# Altium project ESP32_IoT Gateaway.PrjPcb (part 2 of 2)

## Sheet SD Card.SchDoc
size 152 x 152 mm
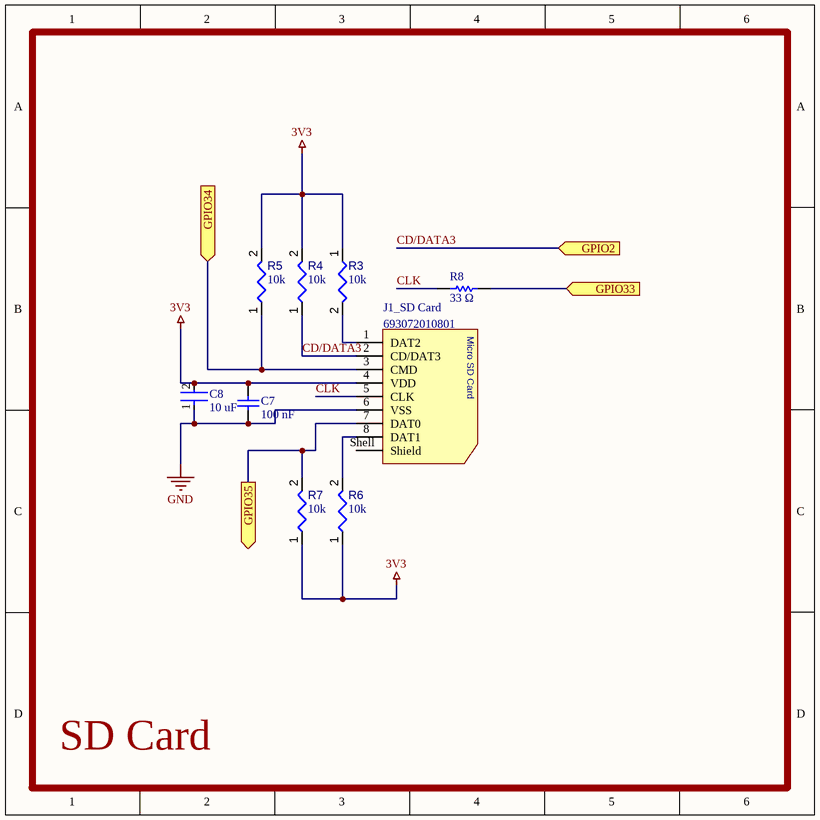
[diagram p6: SD Card.SchDoc]

### Parts
C7  100 nF  [MURA-0603_H_0.9_M]
C8  10 uF  [FP-GRM188-0_1-e0_2_0_55-IPC_A]
J1_SD_Card  693072010801  [693072010801]
R3  value 10k  [RESC1608X55X25ML10T15]  (hidden comment: Resistor 10k +/-1% 0603 100 mW)
R4  value 10k  [RESC1608X55X25ML10T15]  (hidden comment: Resistor 10k +/-1% 0603 100 mW)
R5  value 10k  [RESC1608X55X25ML10T15]  (hidden comment: Resistor 10k +/-1% 0603 100 mW)
R6  value 10k  [RESC1608X55X25ML10T15]  (hidden comment: Resistor 10k +/-1% 0603 100 mW)
R7  value 10k  [RESC1608X55X25ML10T15]  (hidden comment: Resistor 10k +/-1% 0603 100 mW)
R8  33 Ω  [RESC1608X55X25LL10T15]

### Ports
GPIO2 (in), GPIO33 (in), GPIO34 (in), GPIO35 (out)

### Nets
3V3: C7.1 C8.2 J1_SD_Card.4(VDD) R3.1 R4.2 R5.2 R6.1 R7.1
GND: C7.2 C8.1 J1_SD_Card.6(VSS)
CD/DATA3: J1_SD_Card.2(CD/DAT3) R4.1 ; port GPIO2
CLK: J1_SD_Card.5(CLK) R8.2
NetESP32S3_38: R8.1 ; port GPIO33
NetESP32S3_39: J1_SD_Card.3(CMD) R5.1 ; port GPIO34
NetESP32S3_40: J1_SD_Card.7(DAT0) R7.2 ; port GPIO35
NetJ1_SD_Card_1: J1_SD_Card.1(DAT2) R3.2
NetJ1_SD_Card_8: J1_SD_Card.8(DAT1) R6.2

Not connected (* = marked no-connect by the designer): J1_SD_Card Shell(Shield)

### Notes on the sheet
- SD Card
- (in symbol CMP-1502-00164-3) Micro SD Card

### Library data of the parts
C7 = CMP-2000-05253-1: CAP, Ceramic, 0.1 uF, 10%, 16 V, 0603, RoHS, Tape and Reel; Manufacturer: Murata; Capacitance - pF: 100000pF; Case Length: 1.6mm; Voltage Rating DC: 16V; Brand: MurataElectronics; Temperature Coefficient / Code: +/-15%; Case Width: 0.8mm; Type: GeneralPurposeMLCC; Capacitance: 0.1uF; Dielectric: X7R; Capacitance - nF: 100nF; Product Category: MultilayerCeramicCapacitorsMLCC-SMD/SMT; Datasheet URL: https://datasheet.ciiva.com/29202/451467-da-01-en-vs-kondensator-0603-29202287.pdf; Termination Style: SMD/SMT; Operating Temperature Range: -55Cto+125C; Case Code - in: 0603; Datasheet Version: Dec-10; Dimensions: 0.8mmWx1.6mmLx0.8mmH; RoHS: Details; Case Code - mm: 1608; Product: GeneralTypeMLCCs; Voltage Rating: 16V; Package / Case: 0603(1608metric); Factory Pack Quantity: 4000; Packaging: Reel; Maximum Operating Temperature: +125C; Manufacturer URL: http://www.murata.com/; Case Height: 0.8mm; Minimum Operating Temperature: -55C; Series: GRM; Tolerance: 10%
C8 = CMP-2006-02792-2: Chip Multilayer Ceramic Capacitors for General Purpose, 0603, 10uF, X5R, 15%, 20%, 6.3V; Packaging: Tape and Reel; Voltage Rating (DC): 6.3V; Width: 0.031inch; Termination: SMD/SMT; Dielectric: X5R; Package Quantity: 4000; Voltage Rating: 6.3V; Capacitance: 10uF; Case/Package: 0603; Min Operating Temperature: -55°C; Voltage: 6.3V; Length: 1.6mm; Thickness: 0.035inch; Lead Free: Lead Free; Depth: 0.8mm; Case Code (Imperial): 0603; Max Operating Temperature: 85°C; Material: Ceramic; Height: 0.8mm; Tolerance: 20%; Mount: Surface Mount; REACH SVHC: No SVHC; Radiation Hardening: No; Case Code (Metric): 1608
J1_SD_Card = CMP-1502-00164-3: Conn, Memory Skt, Microsd, 8POS, Hinged Rohs Compliant: Yes; Insulation Resistance: 1GΩ; Connector Type: Connector; Memory Type: FLASH; Number of Contacts: 8; Voltage Rating: 100V; Current Rating: 500mA; Contact Material: Gold; Min Operating Temperature: -25°C; Number of Pins: 8; Contact Plating: Gold; REACH SVHC: Unknown; RoHS: Compliant; Color: Black; Number of Positions: 8; Mount: Surface Mount; Length: 14.5mm; Height: 1.95mm; Packaging: Tape and Reel; Max Operating Temperature: 85°C; Width: 13.5mm; Operating Supply Voltage: 100V
R3-R7 = CMP-009-00017-5: Chip Resistor, 10 KOhm, +/- 1%, 01 W, -55 to 155 degC, 0603 (1608 Metric); Voltage Rating: 50V; Power: 100mW; RoHS Compliant: True; Min Operating Temperature: -55°C; Pins: 2; Case/Package: 0603; Mounting Technology: SM; Max Operating Temperature: 155°C; Tolerance: 1%
R8 = CMP-2000-06939-1: Chip Resistor, 33 Ohm, +/- 1%, 0.1 W, -55 to 155 degC, 0603 (1608 Metric), RoHS, Tape and Reel; Temperature Coefficient: 100PPM/C; Voltage Rating: 75V; Unit Weight: 0.000071oz; Power Rating: 100mW; Brand: Yageo; Resistance: 33Ohms; Product Category: ThickFilmResistors; Packaging: Reel; Tolerance: 1%; RoHS: True; Height: 0.45mm; Case Code - mm: 1608; Series: RC; Datasheet URL: http://www.yageo.com/documents/recent/PYu-RC_Group_51_RoHS_L_7.pdf; Operating Temperature Range: -55Cto+155C; Type: GeneralPurposeChipResistorSurfaceMount; Product: ThickFilmResistorsGeneralPurpose; Package / Case: 0603(1608metric); Width: 0.8mm; Length: 1.6mm; Case Code - in: 0603; Mounting Technology: SurfaceMount; Manufacturer URL: http://www.yageo.com/; Manufacturer: Yageo; Package Reference: 0603; Termination Style: SMD/SMT; Datasheet Version: Rev. 7, 05/2017; Package Description: 2-Pin Surface Mount Device, Body 1.6 x 0.8 mm

## Sheet I2C Bus.SchDoc
size A
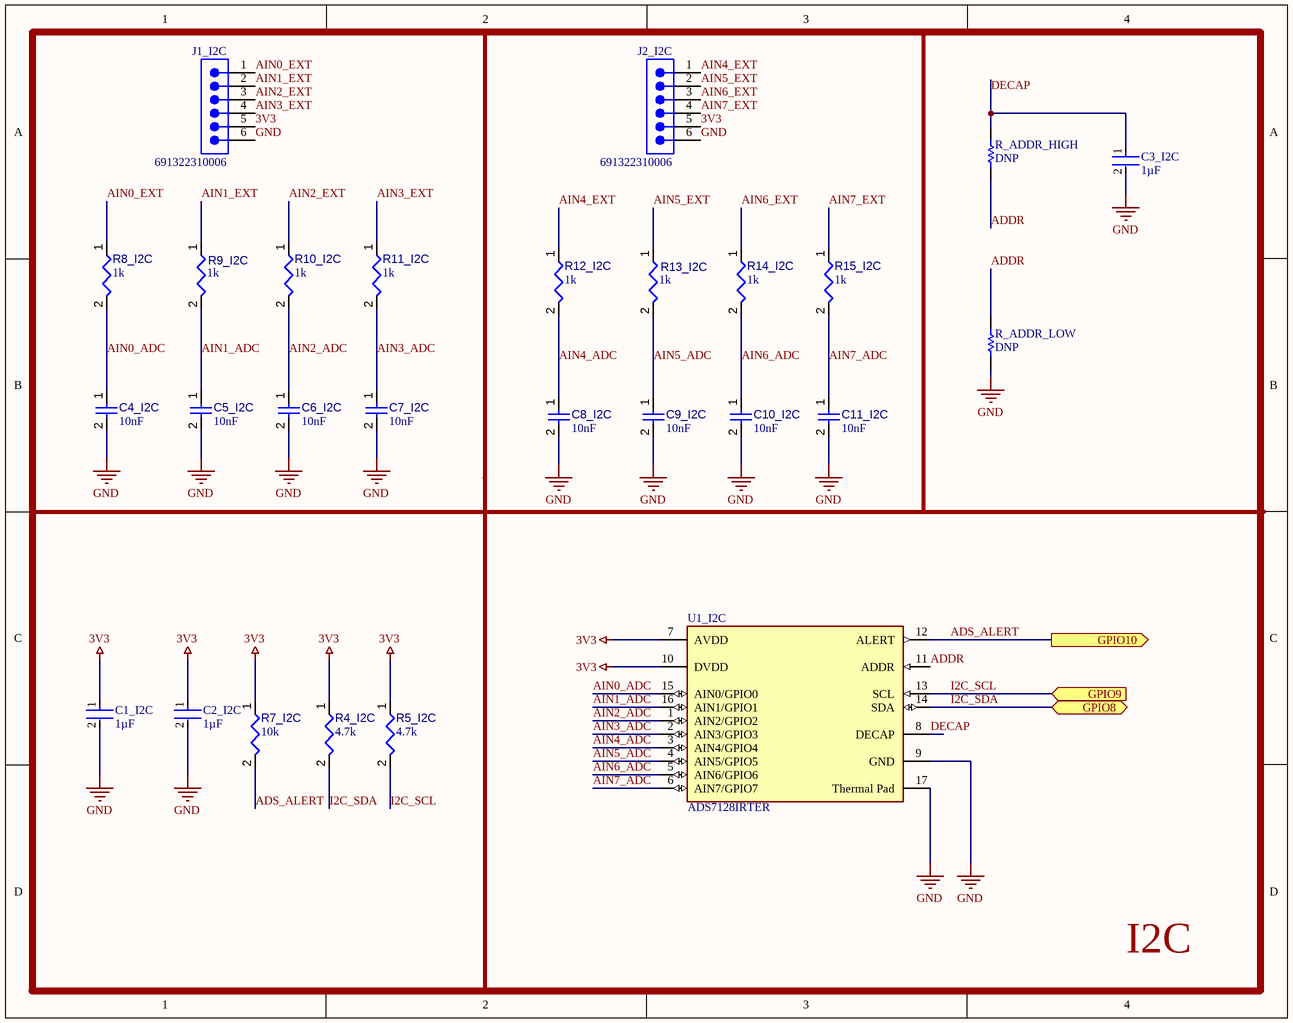
[diagram p7: I2C Bus.SchDoc]

### Parts
C1_I2C  value 1µF  [FP-AC0805-0_85-IPC_A]  (hidden comment: AC0805KKX7R5BB105)
C2_I2C  value 1µF  [FP-AC0805-0_85-IPC_A]  (hidden comment: AC0805KKX7R5BB105)
C3_I2C  value 1µF  [FP-AC0805-0_85-IPC_A]  (hidden comment: AC0805KKX7R5BB105)
C4_I2C  value 10nF  [CAPC0402(1005)60_L]  (hidden comment: Capacitor 10nF +/-20% 50V 0402)
C5_I2C  value 10nF  [CAPC0402(1005)60_L]  (hidden comment: Capacitor 10nF +/-20% 50V 0402)
C6_I2C  value 10nF  [CAPC0402(1005)60_L]  (hidden comment: Capacitor 10nF +/-20% 50V 0402)
C7_I2C  value 10nF  [CAPC0402(1005)60_L]  (hidden comment: Capacitor 10nF +/-20% 50V 0402)
C8_I2C  value 10nF  [CAPC0402(1005)60_L]  (hidden comment: Capacitor 10nF +/-20% 50V 0402)
C9_I2C  value 10nF  [CAPC0402(1005)60_L]  (hidden comment: Capacitor 10nF +/-20% 50V 0402)
C10_I2C  value 10nF  [CAPC0402(1005)60_L]  (hidden comment: Capacitor 10nF +/-20% 50V 0402)
C11_I2C  value 10nF  [CAPC0402(1005)60_L]  (hidden comment: Capacitor 10nF +/-20% 50V 0402)
J1_I2C  691322310006  [691322310006]
J2_I2C  691322310006  [691322310006]
R4_I2C  value 4.7k  [RESC1608X55X25ML10T15]  (hidden comment: Resistor 4k7 +/-1% 0603 100 mW)
R5_I2C  value 4.7k  [RESC1608X55X25ML10T15]  (hidden comment: Resistor 4k7 +/-1% 0603 100 mW)
R7_I2C  value 10k  [RESC0402(1005)_L]  (hidden comment: Resistor 10K  +/-1 % 0402 63 mW)
R8_I2C  value 1k  [RESC0805(2012)_L]  (hidden comment: Resistor 1K +/-5% 0805 125 mW)
R9_I2C  value 1k  [RESC0805(2012)_L]  (hidden comment: Resistor 1K +/-5% 0805 125 mW)
R10_I2C  value 1k  [RESC0805(2012)_L]  (hidden comment: Resistor 1K +/-5% 0805 125 mW)
R11_I2C  value 1k  [RESC0805(2012)_L]  (hidden comment: Resistor 1K +/-5% 0805 125 mW)
R12_I2C  value 1k  [RESC0805(2012)_L]  (hidden comment: Resistor 1K +/-5% 0805 125 mW)
R13_I2C  value 1k  [RESC0805(2012)_L]  (hidden comment: Resistor 1K +/-5% 0805 125 mW)
R14_I2C  value 1k  [RESC0805(2012)_L]  (hidden comment: Resistor 1K +/-5% 0805 125 mW)
R15_I2C  value 1k  [RESC0805(2012)_L]  (hidden comment: Resistor 1K +/-5% 0805 125 mW)
R_ADDR_HIGH  value DNP  [RESC1005X40X25ML05T05]  (hidden comment: Resistor 0R +/- 5% 0402 100 mW)
R_ADDR_LOW  value DNP  [RESC1005X40X25ML05T05]  (hidden comment: Resistor 0R +/- 5% 0402 100 mW)
U1_I2C  ADS7128IRTER  [FP-RTE0016C-IPC_B]

### Ports
GPIO8 (bidir), GPIO9 (in), GPIO10 (out)

### Nets
3V3: C1_I2C.1 C2_I2C.1 J1_I2C.5 J2_I2C.5 R4_I2C.1 R5_I2C.1 R7_I2C.1 U1_I2C.7(AVDD) U1_I2C.10(DVDD)
GND: C1_I2C.2 C2_I2C.2 C3_I2C.2 C4_I2C.2 C5_I2C.2 C6_I2C.2 C7_I2C.2 C8_I2C.2 C9_I2C.2 C10_I2C.2 C11_I2C.2 J1_I2C.6 J2_I2C.6 R_ADDR_LOW.1 U1_I2C.9(GND) U1_I2C.17(Thermal_Pad)
ADDR: R_ADDR_HIGH.1 R_ADDR_LOW.2 U1_I2C.11(ADDR)
ADS_ALERT: R7_I2C.2 U1_I2C.12(ALERT) ; port GPIO10
AIN0_ADC: C4_I2C.1 R8_I2C.2 U1_I2C.15(AIN0/GPIO0)
AIN0_EXT: J1_I2C.1 R8_I2C.1
AIN1_ADC: C5_I2C.1 R9_I2C.2 U1_I2C.16(AIN1/GPIO1)
AIN1_EXT: J1_I2C.2 R9_I2C.1
AIN2_ADC: C6_I2C.1 R10_I2C.2 U1_I2C.1(AIN2/GPIO2)
AIN2_EXT: J1_I2C.3 R10_I2C.1
AIN3_ADC: C7_I2C.1 R11_I2C.2 U1_I2C.2(AIN3/GPIO3)
AIN3_EXT: J1_I2C.4 R11_I2C.1
AIN4_ADC: C8_I2C.1 R12_I2C.2 U1_I2C.3(AIN4/GPIO4)
AIN4_EXT: J2_I2C.1 R12_I2C.1
AIN5_ADC: C9_I2C.1 R13_I2C.2 U1_I2C.4(AIN5/GPIO5)
AIN5_EXT: J2_I2C.2 R13_I2C.1
AIN6_ADC: C10_I2C.1 R14_I2C.2 U1_I2C.5(AIN6/GPIO6)
AIN6_EXT: J2_I2C.3 R14_I2C.1
AIN7_ADC: C11_I2C.1 R15_I2C.2 U1_I2C.6(AIN7/GPIO7)
AIN7_EXT: J2_I2C.4 R15_I2C.1
DECAP: C3_I2C.1 R_ADDR_HIGH.2 U1_I2C.8(DECAP)
I2C_SCL: R5_I2C.2 U1_I2C.13(SCL) ; port GPIO9
I2C_SDA: R4_I2C.2 U1_I2C.14(SDA) ; port GPIO8

### Notes on the sheet
- I2C

### Library data of the parts
C1_I2C C2_I2C C3_I2C = CMP-001-00084-1: 6.3V 1uF X7R ±10% 0805 Multilayer Ceramic Capacitors MLCC - SMD/SMT ROHS; China RoHS: Compliant; Introduction Date: 2022-09-21; REACH SVHC: Yes; Tolerance: 10%; Dielectric: X7R; Height: 1.25mm; Dielectric Material: Ceramic; Number of Terminals: 2; Ratings: AEC-Q200; Case/Package: 0805; Length: 2mm; Mounting Technology: Surface Mount; Export Control Classification Number (ECCN) Code: EAR99; RoHS: Compliant; Material: Ceramic; Max Operating Temperature: 125°C; Voltage Rating (DC): 6.3V; Voltage Rating: 6.3V; Width: 1.25mm; Lifecycle Status: Production; Min Operating Temperature: -55°C; Country of Origin: Mainland China, Taiwan
C4_I2C C5_I2C C6_I2C C7_I2C C8_I2C C9_I2C C10_I2C C11_I2C = CMP-001-00069-3: Chip Capacitor, 10nF +/-20%, 50V, 0402, Thickness 0.6 mm; Tolerance: 5%; Max Operating Temperature: 85°C; Pins: 2; Case/Package: 0402; Voltage Rating: 50V; Min Operating Temperature: -55°C; Mounting Technology: SMT
J1_I2C J2_I2C = CMP-002-00076-1: Wurth Elektronik 3.81mmpitch6pPlug-in terminal blocks socket head, 322series, 300.0 v, welding; Manufacturer Lifecycle Status: ACTIVE; Current: 10A; Number of Contacts: 6; Pitch: 3.81mm; Number of Levels: 1; YEOL: 1 = Estimated lifetime > 10 years; Gender: Male; Voltage: 300V; Contact Plating: Tin; Number of Positions Per Level: 6; Width: 24.25mm; Color: Green; Length: 24.05mm; Packaging: Box; Number of Rows: 1; Contact Material: Brass; Max Operating Temperature: 105°C; Mounting Technology: Through Hole; RoHS: Compliant; REACH SVHC: No; Height: 9.2mm; Lead Pitch: 3.81mm; Termination: Solder; Pins: 6; Lifecycle Status: Production; Min Operating Temperature: -40°C
R4_I2C R5_I2C = CMP-009-00031-5: Chip Resistor, 4.7 KOhm, +/- 1%, 0.1 W, -55 to 155 degC, 0603 (1608 Metric); Power: 100mW; Tolerance: 1%; Mounting Technology: SM; Case/Package: 0603; RoHS Compliant: True; Pins: 2; Min Operating Temperature: -55°C; Max Operating Temperature: 155°C
R7_I2C = CMP-009-00149-3: Chip Resistor, 10 kOhms, +/-1 %, 63 mW, -55 to 125 degC, 0402; Power: 63mW; Tolerance: 1%; Min Operating Temperature: -55°C; Case/Package: 0402; Max Operating Temperature: 155°C; Pins: 2
R8_I2C R9_I2C R10_I2C R11_I2C R12_I2C R13_I2C R14_I2C R15_I2C = CMP-009-00118-3: Chip Resistor, 1 kOhms, +/-5%, 125 mW, -55 to 155 degC, 0805; Tolerance: 5%; Power: 125mW; Case/Package: 0805; Pins: 2; Min Operating Temperature: -55°C; Max Operating Temperature: 155°C
R_ADDR_HIGH R_ADDR_LOW = CMP-009-00005-5: Chip Resistor, 0 Ohm, 0.1 W, -55 to 155 degC, 0402 (1005 Metric); Power: 100mW; Voltage Rating: 50V; Pins: 2; Tolerance: 5%; Case/Package: 0402; Mounting Technology: SM; Max Operating Temperature: 155°C; Min Operating Temperature: -55°C; RoHS Compliant: True
U1_I2C = CMP-031-00007-1: IC ADC 12BIT SAR 16WQFN / 12 Bit Analog to Digital Converter 8 Input 1 SAR 16-WQFN (3x3); Manufacturer Lifecycle Status: ACTIVE; Min Supply Voltage: 1.65V; Max Supply Voltage: 5.5V; Max Junction Temperature (Tj): 125°C; Number of Converters: 1; Number of Channels: 8; Interface: I2C; RoHS: Compliant; Max Operating Temperature: 85°C; Height: 800µm; Pins: 16; Width: 3mm; Length: 3mm; Lifecycle Status: Production; Min Operating Temperature: -40°C; Ambient Temperature Range High: 85°C; Thickness: 750µm

## Sheet GPIO Direct.SchDoc
size 381 x 241 mm
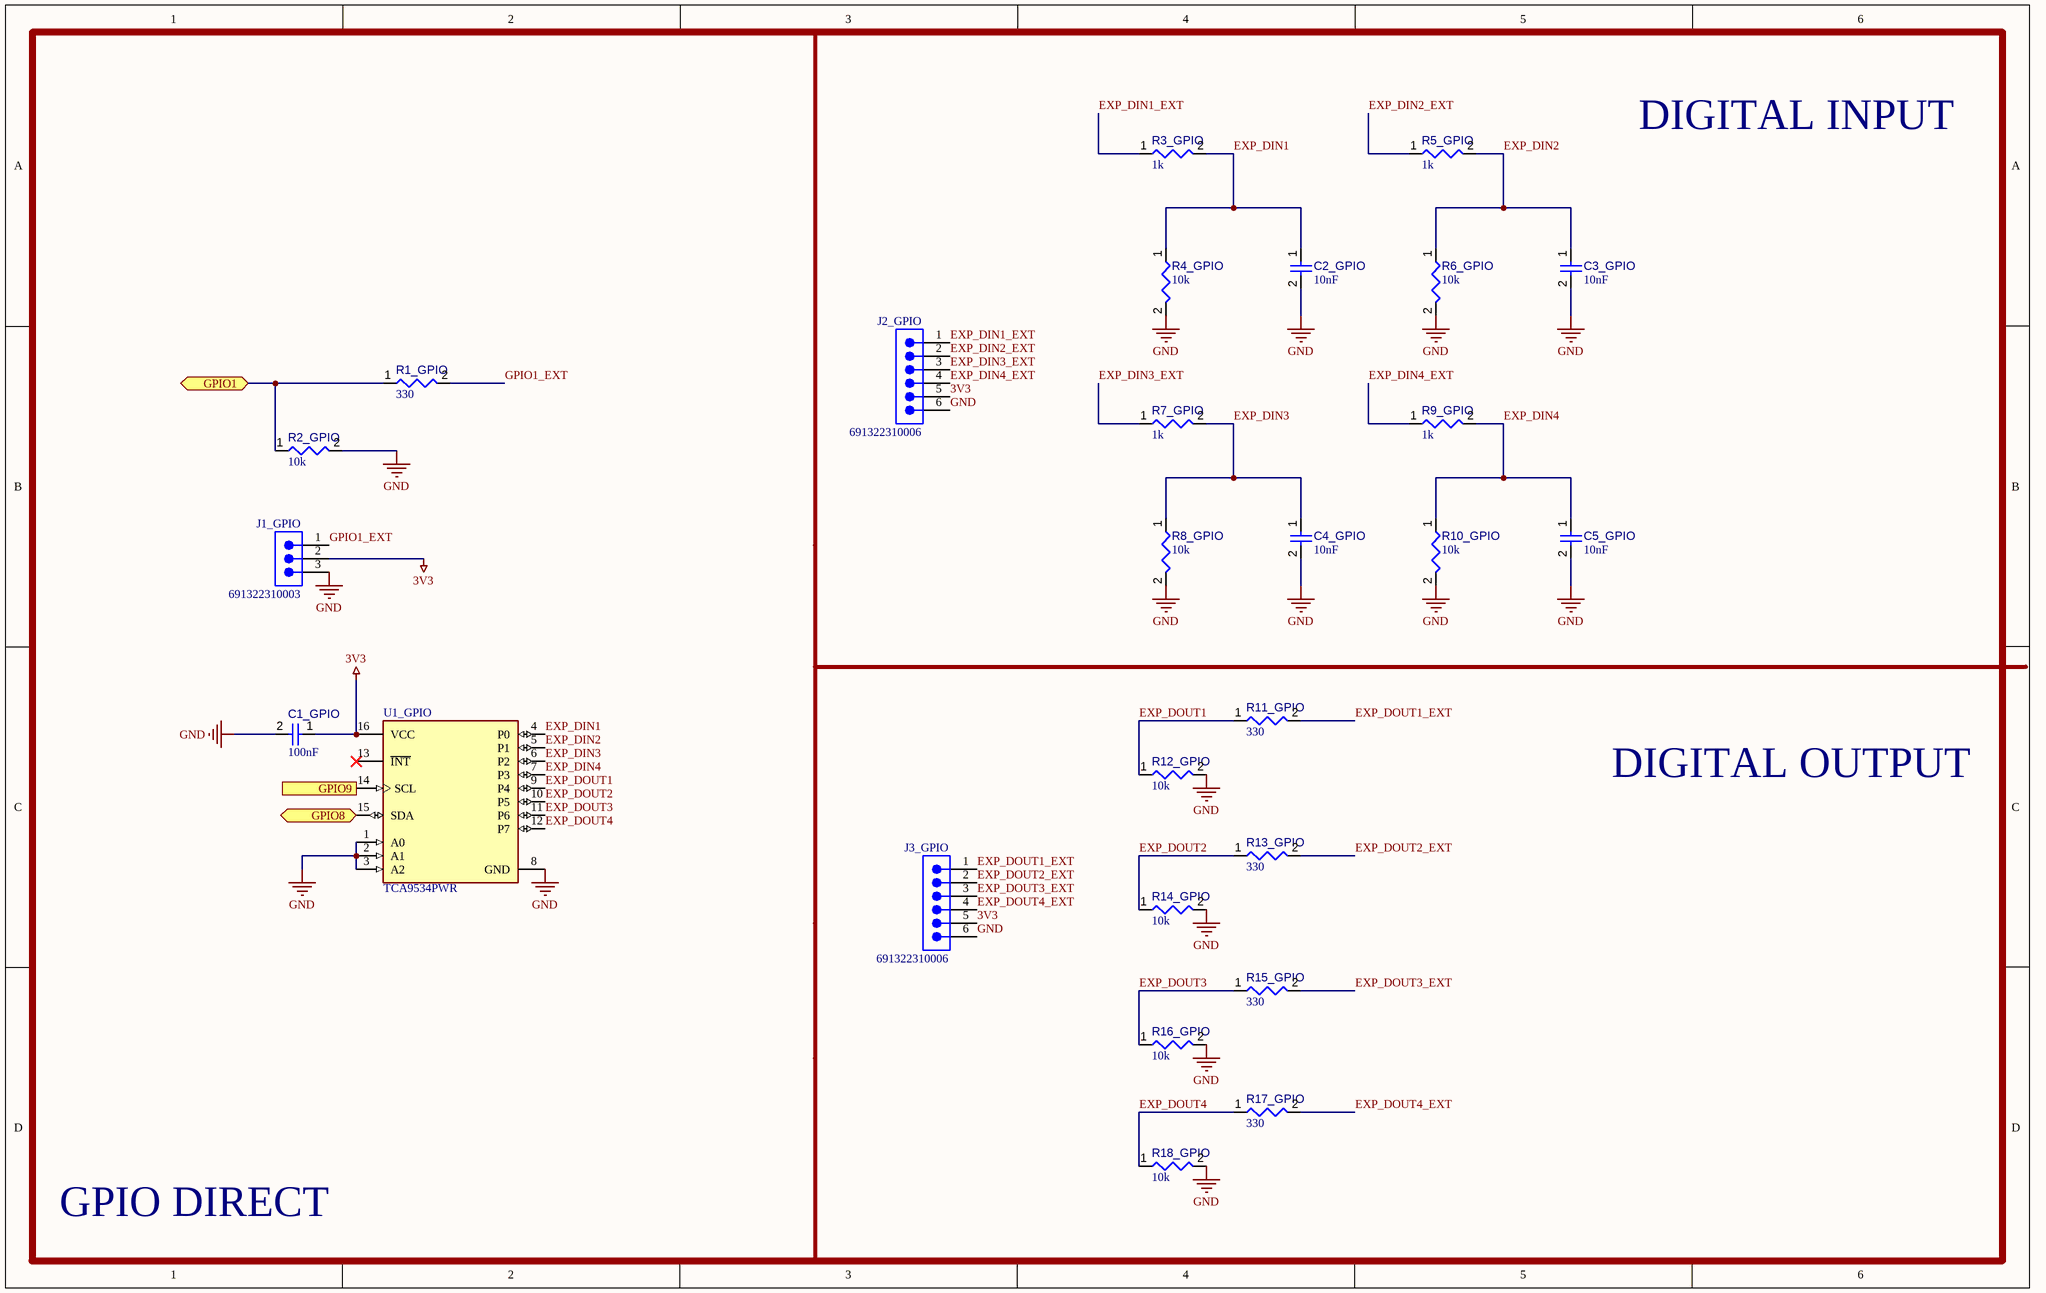
[diagram p8: GPIO Direct.SchDoc]

### Parts
C1_GPIO  value 100nF  [CAPC1608X90X40NL10T20]  (hidden comment: Capacitor 100 nF +/-10% 50 V 0603)
C2_GPIO  value 10nF  [CAPC0402(1005)60_L]  (hidden comment: Capacitor 10nF +/-20% 50V 0402)
C3_GPIO  value 10nF  [CAPC0402(1005)60_L]  (hidden comment: Capacitor 10nF +/-20% 50V 0402)
C4_GPIO  value 10nF  [CAPC0402(1005)60_L]  (hidden comment: Capacitor 10nF +/-20% 50V 0402)
C5_GPIO  value 10nF  [CAPC0402(1005)60_L]  (hidden comment: Capacitor 10nF +/-20% 50V 0402)
J1_GPIO  691322310003  [691322310003]
J2_GPIO  691322310006  [691322310006]
J3_GPIO  691322310006  [691322310006]
R1_GPIO  value 330  [RESC0402(1005)_L]  (hidden comment: Resistor 330R +/-5 % 0402 63 mW)
R2_GPIO  value 10k  [RESC0402(1005)_L]  (hidden comment: Resistor 10K  +/-1 % 0402 63 mW)
R3_GPIO  value 1k  [RESC1608X55X25ML10T15]  (hidden comment: Resistor 1k +/-1% 0603 100 mW)
R4_GPIO  value 10k  [RESC1005X40X25ML05T05]  (hidden comment: Resistor 10k +/-1% 0402 63 mW)
R5_GPIO  value 1k  [RESC1608X55X25ML10T15]  (hidden comment: Resistor 1k +/-1% 0603 100 mW)
R6_GPIO  value 10k  [RESC1005X40X25ML05T05]  (hidden comment: Resistor 10k +/-1% 0402 63 mW)
R7_GPIO  value 1k  [RESC1608X55X25ML10T15]  (hidden comment: Resistor 1k +/-1% 0603 100 mW)
R8_GPIO  value 10k  [RESC1005X40X25ML05T05]  (hidden comment: Resistor 10k +/-1% 0402 63 mW)
R9_GPIO  value 1k  [RESC1608X55X25ML10T15]  (hidden comment: Resistor 1k +/-1% 0603 100 mW)
R10_GPIO  value 10k  [RESC1005X40X25ML05T05]  (hidden comment: Resistor 10k +/-1% 0402 63 mW)
R11_GPIO  value 330  [RESC0402(1005)_L]  (hidden comment: Resistor 330R +/-5 % 0402 63 mW)
R12_GPIO  value 10k  [RESC0402(1005)_L]  (hidden comment: Resistor 10K  +/-1 % 0402 63 mW)
R13_GPIO  value 330  [RESC0402(1005)_L]  (hidden comment: Resistor 330R +/-5 % 0402 63 mW)
R14_GPIO  value 10k  [RESC0402(1005)_L]  (hidden comment: Resistor 10K  +/-1 % 0402 63 mW)
R15_GPIO  value 330  [RESC0402(1005)_L]  (hidden comment: Resistor 330R +/-5 % 0402 63 mW)
R16_GPIO  value 10k  [RESC0402(1005)_L]  (hidden comment: Resistor 10K  +/-1 % 0402 63 mW)
R17_GPIO  value 330  [RESC0402(1005)_L]  (hidden comment: Resistor 330R +/-5 % 0402 63 mW)
R18_GPIO  value 10k  [RESC0402(1005)_L]  (hidden comment: Resistor 10K  +/-1 % 0402 63 mW)
U1_GPIO  TCA9534PWR  [FP-PW0016A-IPC_B]

### Ports
GPIO1 (bidir), GPIO8 (bidir), GPIO9 (in)

### Nets
3V3: C1_GPIO.1 J1_GPIO.2 J2_GPIO.5 J3_GPIO.5 U1_GPIO.16(VCC)
GND: C1_GPIO.2 C2_GPIO.2 C3_GPIO.2 C4_GPIO.2 C5_GPIO.2 J1_GPIO.3 J2_GPIO.6 J3_GPIO.6 R2_GPIO.2 R4_GPIO.2 R6_GPIO.2 R8_GPIO.2 R10_GPIO.2 R12_GPIO.2 R14_GPIO.2 R16_GPIO.2 R18_GPIO.2 U1_GPIO.1(A0) U1_GPIO.2(A1) U1_GPIO.3(A2) U1_GPIO.8(GND)
EXP_DIN1: C2_GPIO.1 R3_GPIO.2 R4_GPIO.1 U1_GPIO.4(P0)
EXP_DIN1_EXT: J2_GPIO.1 R3_GPIO.1
EXP_DIN2: C3_GPIO.1 R5_GPIO.2 R6_GPIO.1 U1_GPIO.5(P1)
EXP_DIN2_EXT: J2_GPIO.2 R5_GPIO.1
EXP_DIN3: C4_GPIO.1 R7_GPIO.2 R8_GPIO.1 U1_GPIO.6(P2)
EXP_DIN3_EXT: J2_GPIO.3 R7_GPIO.1
EXP_DIN4: C5_GPIO.1 R9_GPIO.2 R10_GPIO.1 U1_GPIO.7(P3)
EXP_DIN4_EXT: J2_GPIO.4 R9_GPIO.1
EXP_DOUT1: R11_GPIO.1 R12_GPIO.1 U1_GPIO.9(P4)
EXP_DOUT1_EXT: J3_GPIO.1 R11_GPIO.2
EXP_DOUT2: R13_GPIO.1 R14_GPIO.1 U1_GPIO.10(P5)
EXP_DOUT2_EXT: J3_GPIO.2 R13_GPIO.2
EXP_DOUT3: R15_GPIO.1 R16_GPIO.1 U1_GPIO.11(P6)
EXP_DOUT3_EXT: J3_GPIO.3 R15_GPIO.2
EXP_DOUT4: R17_GPIO.1 R18_GPIO.1 U1_GPIO.12(P7)
EXP_DOUT4_EXT: J3_GPIO.4 R17_GPIO.2
GPIO1_EXT: J1_GPIO.1 R1_GPIO.2
I2C_SCL: U1_GPIO.14(SCL) ; port GPIO9
I2C_SDA: U1_GPIO.15(SDA) ; port GPIO8
NetESP32S3_6: R1_GPIO.1 R2_GPIO.1 ; port GPIO1

Not connected (* = marked no-connect by the designer): U1_GPIO 13(~{INT})*

### Notes on the sheet
- DIGITAL INPUT
- DIGITAL OUTPUT
- GPIO DIRECT

### Library data of the parts
C1_GPIO = CMP-001-00017-6: Chip Capacitor, 100 nF, +/- 10%, 50 V, 0603 (1608 Metric); Voltage Rating: 50V; Capacitor Type: Ceramic; Tolerance: 10%; Mounting Technology: SM; Max Operating Temperature: 125°C; RoHS Compliant: True; Pins: 2; Case/Package: 0603; Min Operating Temperature: -55°C
C2_GPIO C3_GPIO C4_GPIO C5_GPIO = CMP-001-00069-3: as C4_I2C on sheet I2C Bus; Max Operating Temperature: 85°C; Pins: 2; Case/Package: 0402; Voltage Rating: 50V; Min Operating Temperature: -55°C; Mounting Technology: SMT
J1_GPIO = CMP-002-00075-1: Wurth Elektronik 3.81mmpitch3pPlug-in terminal blocks socket head, 322series, 300.0 v, welding; Manufacturer Lifecycle Status: ACTIVE; Gender: Male; Current: 10A; Number of Positions Per Level: 3; YEOL: 1 = Estimated lifetime > 10 years; Voltage: 300V; Number of Levels: 1; Pitch: 3.81mm; Contact Plating: Tin; Packaging: Box; Height: 7.2mm; Color: Green; Pins: 3; Max Operating Temperature: 105°C; Length: 12.62mm; Width: 12.82mm; Voltage Rating: 300V; Min Operating Temperature: -40°C; RoHS: Compliant; Lifecycle Status: Production; Current Rating: 10A; Lead Pitch: 3.81mm; Contact Material: Tin; Mounting Technology: Through Hole; Number of Contacts: 3; Number of Rows: 1; Termination: Solder
J2_GPIO J3_GPIO = CMP-002-00076-1: as J1_I2C on sheet I2C Bus; Contact Plating: Tin; Number of Positions Per Level: 6; Width: 24.25mm; Color: Green; Length: 24.05mm; Packaging: Box; Number of Rows: 1; Contact Material: Brass; Max Operating Temperature: 105°C; Mounting Technology: Through Hole; RoHS: Compliant; REACH SVHC: No; Height: 9.2mm; Lead Pitch: 3.81mm; Termination: Solder; Pins: 6; Lifecycle Status: Production; Min Operating Temperature: -40°C
R1_GPIO R11_GPIO R13_GPIO R15_GPIO R17_GPIO = CMP-009-00132-3: Chip Resistor, 330 Ohms, +/-5 %, 63 mW, -55 to 155 degC, 0402; Power: 63mW; Tolerance: 5%; Pins: 2; Max Operating Temperature: 155°C; Min Operating Temperature: -55°C; Case/Package: 0402
R2_GPIO R12_GPIO R14_GPIO R16_GPIO R18_GPIO = CMP-009-00149-3: as R7_I2C on sheet I2C Bus; Min Operating Temperature: -55°C; Case/Package: 0402; Max Operating Temperature: 155°C; Pins: 2
R3_GPIO R5_GPIO R7_GPIO R9_GPIO = CMP-009-00014-5: Chip Resistor, 1 KOhm, +/-1%, 0.1 W, -55 to 155 degC, 0603 (1608 Metric); Voltage Rating: 50V; Power: 100mW; Tolerance: 1%; Mounting Technology: SM; Pins: 2; Case/Package: 0603; Min Operating Temperature: -55°C; RoHS Compliant: True; Max Operating Temperature: 155°C
R4_GPIO R6_GPIO R8_GPIO R10_GPIO = CMP-009-00019-5: Chip Resistor, 10 KOhm, +/- 1%, 63 mW, -55 to 155 degC, 0402 (1005 Metric); Power: 63mW; Voltage Rating: 50V; Case/Package: 0402; Mounting Technology: SM; Pins: 2; Min Operating Temperature: -55°C; Tolerance: 1%; RoHS Compliant: True; Max Operating Temperature: 155°C
U1_GPIO = CMP-031-00008-1: 10mA 25mA I2C 8 1.65V 5.5V 400KHz yes TSSOP-16 SMD mount，glue mount 1.2mm(height); Manufacturer Lifecycle Status: ACTIVE; Max Junction Temperature (Tj): 100°C; Number of I/Os: 8; Frequency: 400kHz; Max Operating Temperature: 85°C; Width: 4.4mm; Packaging: Cut Tape (CT); Height: 1.2mm; Mounting Technology: Surface Mount; Min Supply Voltage: 1.65V; Min Operating Temperature: -40°C; Pins: 16; Ambient Temperature Range High: 85°C; Lead Free: Lead Free; Schedule B: 8542390000, 8542390000; Length: 5mm; Max Supply Voltage: 5.5V; Interface: I2C; Number of Channels: 8; Lifecycle Status: Production; Number of Outputs: 8; Thickness: 1mm; Case/Package: TSSOP; RoHS: Compliant

## Nets that join several sheets
3V3: UART Bus (6 pins), Minimum_system (22 pins), SPI Bus (C2_CAN.2 U1_SPI.3), Ethernet PHY (26 pins), Power Regulator (COUT.1 L1_Power_Reg.2 U1_PWR.7 U1_PWR.14), SD Card (8 pins), I2C Bus (9 pins), GPIO Direct (5 pins)
5V: Minimum_system (11 pins), Power Regulator (8 pins)
GND: UART Bus (23 pins), Minimum_system (50 pins), SPI Bus (C2_CAN.1 P1_SPI.3 U1_SPI.2 U1_SPI.8), Ethernet PHY (24 pins), Power Regulator (12 pins), SD Card (C7.2 C8.1 J1_SD_Card.6), I2C Bus (16 pins), GPIO Direct (21 pins)
ADS_ALERT: Minimum_system (ESP32S3.15), I2C Bus (R7_I2C.2 U1_I2C.12)
CD/DATA3: Minimum_system (ESP32S3.7), SD Card (J1_SD_Card.2 R4.1)
D_N: UART Bus (PCIE_.36), Minimum_system (R3_USB.1)
D_P: UART Bus (PCIE_.38), Minimum_system (R2_USB.1)
I2C_SCL: Minimum_system (ESP32S3.14), I2C Bus (R5_I2C.2 U1_I2C.13), GPIO Direct (U1_GPIO.14)
I2C_SDA: Minimum_system (ESP32S3.13), I2C Bus (R4_I2C.2 U1_I2C.14), GPIO Direct (U1_GPIO.15)
NetESP32S3_6: Minimum_system (ESP32S3.6), GPIO Direct (R1_GPIO.1 R2_GPIO.1)
NetESP32S3_9: Minimum_system (ESP32S3.9), SPI Bus (U1_SPI.1)
NetESP32S3_10: Minimum_system (ESP32S3.10), SPI Bus (U1_SPI.4)
NetESP32S3_11: Minimum_system (ESP32S3.11), Ethernet PHY (R1_Ethernet.1 U1_Ethernet.37)
NetESP32S3_12: Minimum_system (ESP32S3.12), Ethernet PHY (R2_Ethernet.1 U1_Ethernet.36)
NetESP32S3_16: UART Bus (PCIE_.11), Minimum_system (ESP32S3.16)
NetESP32S3_17: UART Bus (PCIE_.13), Minimum_system (ESP32S3.17)
NetESP32S3_18: UART Bus (PCIE_.23), Minimum_system (ESP32S3.18)
NetESP32S3_19: UART Bus (PCIE_.25), Minimum_system (ESP32S3.19)
NetESP32S3_23: UART Bus (RS485_Transceiver.4), Minimum_system (ESP32S3.23)
NetESP32S3_24: UART Bus (RS485_Transceiver.1), Minimum_system (ESP32S3.24)
NetESP32S3_27: Minimum_system (ESP32S3.27), Ethernet PHY (U1_Ethernet.32)
NetESP32S3_38: Minimum_system (ESP32S3.38), SD Card (R8.1)
NetESP32S3_39: Minimum_system (ESP32S3.39), SD Card (J1_SD_Card.3 R5.1)
NetESP32S3_40: Minimum_system (ESP32S3.40), SD Card (J1_SD_Card.7 R7.2)
NetESP32S3_41: Minimum_system (ESP32S3.41), Ethernet PHY (U1_Ethernet.33)
NetESP32S3_42: Minimum_system (ESP32S3.42), Ethernet PHY (U1_Ethernet.35)
NetESP32S3_43: Minimum_system (ESP32S3.43), Ethernet PHY (U1_Ethernet.34)